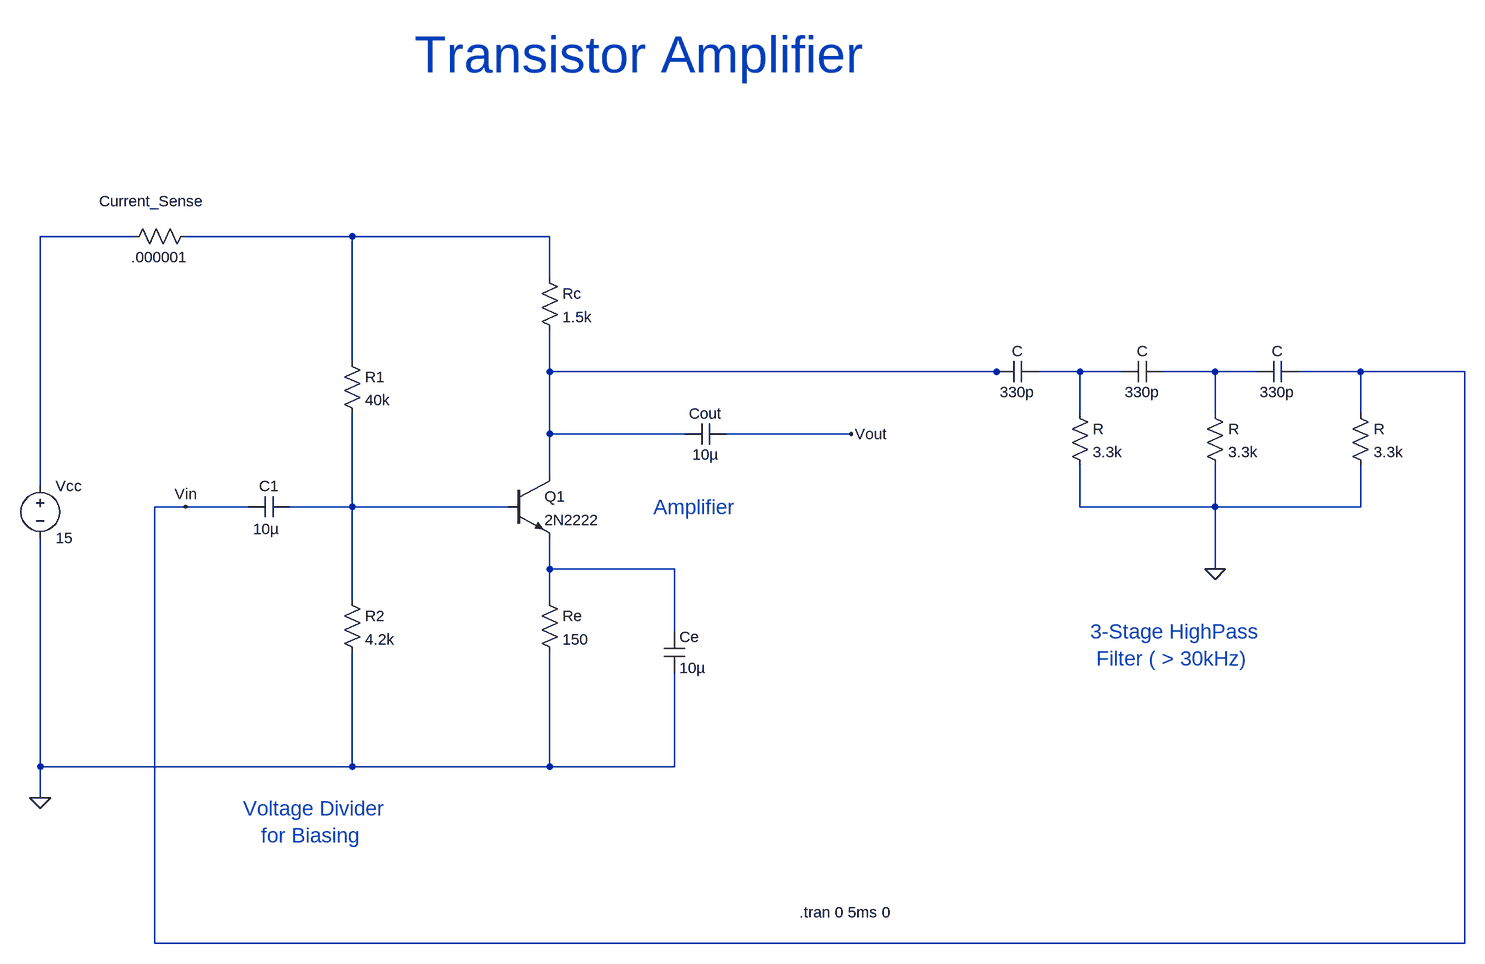
[diagram p0: schematic Schematic.asc]
Schematic.asc, the LTspice schematic file:
Version 4
SHEET 1 1860 680
WIRE -192 -1072 -336 -1072
WIRE 144 -1072 -112 -1072
WIRE 448 -1072 144 -1072
WIRE 448 -1008 448 -1072
WIRE 144 -880 144 -1072
WIRE 448 -864 448 -928
WIRE 1136 -864 448 -864
WIRE 1152 -864 1136 -864
WIRE 1264 -864 1200 -864
WIRE 1328 -864 1264 -864
WIRE 1472 -864 1392 -864
WIRE 1536 -864 1472 -864
WIRE 1696 -864 1600 -864
WIRE 1856 -864 1696 -864
WIRE 1264 -800 1264 -864
WIRE 1472 -800 1472 -864
WIRE 1696 -800 1696 -864
WIRE 448 -768 448 -864
WIRE 656 -768 448 -768
WIRE 912 -768 720 -768
WIRE 448 -704 448 -768
WIRE -336 -688 -336 -1072
WIRE -112 -656 -160 -656
WIRE -16 -656 -112 -656
WIRE 144 -656 144 -800
WIRE 144 -656 48 -656
WIRE 384 -656 144 -656
WIRE 1264 -656 1264 -720
WIRE 1472 -656 1472 -720
WIRE 1472 -656 1264 -656
WIRE 1696 -656 1696 -720
WIRE 1696 -656 1472 -656
WIRE 448 -560 448 -608
WIRE 640 -560 448 -560
WIRE 1472 -560 1472 -656
WIRE 144 -512 144 -656
WIRE 448 -512 448 -560
WIRE 640 -464 640 -560
WIRE -336 -256 -336 -608
WIRE 144 -256 144 -432
WIRE 144 -256 -336 -256
WIRE 448 -256 448 -432
WIRE 448 -256 144 -256
WIRE 640 -256 640 -400
WIRE 640 -256 448 -256
WIRE -336 -208 -336 -256
WIRE -160 16 -160 -656
WIRE 1856 16 1856 -864
WIRE 1856 16 -160 16
FLAG -336 -208 0
FLAG 912 -768 Vout
FLAG 1472 -560 0
FLAG -112 -656 Vin
SYMBOL npn 384 -704 R0
SYMATTR InstName Q1
SYMATTR Value 2N2222
SYMBOL voltage -336 -704 R0
WINDOW 123 0 0 Left 0
WINDOW 39 0 0 Left 0
SYMATTR InstName Vcc
SYMATTR Value 15
SYMBOL res 432 -528 R0
SYMATTR InstName Re
SYMATTR Value 150
SYMBOL res 432 -1024 R0
SYMATTR InstName Rc
SYMATTR Value 1.5k
SYMBOL res 128 -528 R0
SYMATTR InstName R2
SYMATTR Value 4.2k
SYMBOL res 128 -896 R0
SYMATTR InstName R1
SYMATTR Value 40k
SYMBOL cap 720 -784 R90
WINDOW 0 0 32 VBottom 2
WINDOW 3 32 32 VTop 2
SYMATTR InstName Cout
SYMATTR Value 10µ
SYMBOL res -96 -1088 R90
WINDOW 0 -23 68 VBottom 2
WINDOW 3 32 56 VTop 2
SYMATTR InstName Current_Sense
SYMATTR Value .000001
SYMBOL cap 624 -464 R0
SYMATTR InstName Ce
SYMATTR Value 10µ
SYMBOL cap 1200 -880 R90
WINDOW 0 0 32 VBottom 2
WINDOW 3 32 32 VTop 2
SYMATTR InstName C
SYMATTR Value 330p
SYMBOL cap 1392 -880 R90
WINDOW 0 0 32 VBottom 2
WINDOW 3 32 32 VTop 2
SYMATTR InstName C
SYMATTR Value 330p
SYMBOL cap 1600 -880 R90
WINDOW 0 0 32 VBottom 2
WINDOW 3 32 32 VTop 2
SYMATTR InstName C
SYMATTR Value 330p
SYMBOL res 1248 -816 R0
SYMATTR InstName R
SYMATTR Value 3.3k
SYMBOL res 1456 -816 R0
SYMATTR InstName R
SYMATTR Value 3.3k
SYMBOL res 1680 -816 R0
SYMATTR InstName R
SYMATTR Value 3.3k
SYMBOL cap 48 -672 R90
WINDOW 0 0 32 VBottom 2
WINDOW 3 35 36 VTop 2
SYMATTR InstName C1
SYMATTR Value 10µ
TEXT 832 -32 Left 2 !.tran 0 5ms 0
TEXT 240 -1352 Left 6 ;Transistor Amplifier
TEXT -24 -192 Left 3 ;Voltage Divider\n   for Biasing
TEXT 608 -656 Left 3 ;Amplifier
TEXT 1280 -464 Left 3 ;3-Stage HighPass \n Filter ( > 30kHz)

The netlist it stands for:
* Schematic.asc
Q1 N003 N006 N007 0 2N2222
Vcc N001 0 15
Re N007 0 150
Rc N002 N003 1.5k
R2 N006 0 4.2k
R1 N002 N006 40k
Cout Vout N003 10µ
R§Current_Sense N002 N001 .000001
Ce N007 0 10µ
C N004 N003 330p
C N005 N004 330p
C Vin N005 330p
R N004 0 3.3k
R N005 0 3.3k
R Vin 0 3.3k
C1 N006 Vin 10µ
.model NPN NPN
.model PNP PNP
.lib standard.bjt
.tran 0 5ms 0
* Transistor Amplifier
* Voltage Divider
*    for Biasing
* Amplifier
* 3-Stage HighPass
*  Filter ( > 30kHz)
.backanno
.end